# EAGLE schematic Snare (EAGLE 9.2.2)
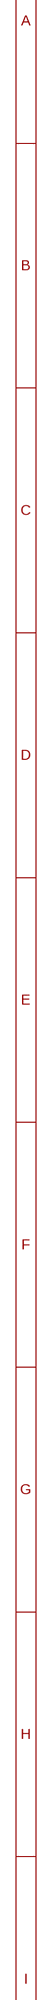
[diagram p0: schematic, sheet 1, part 1 of 2]
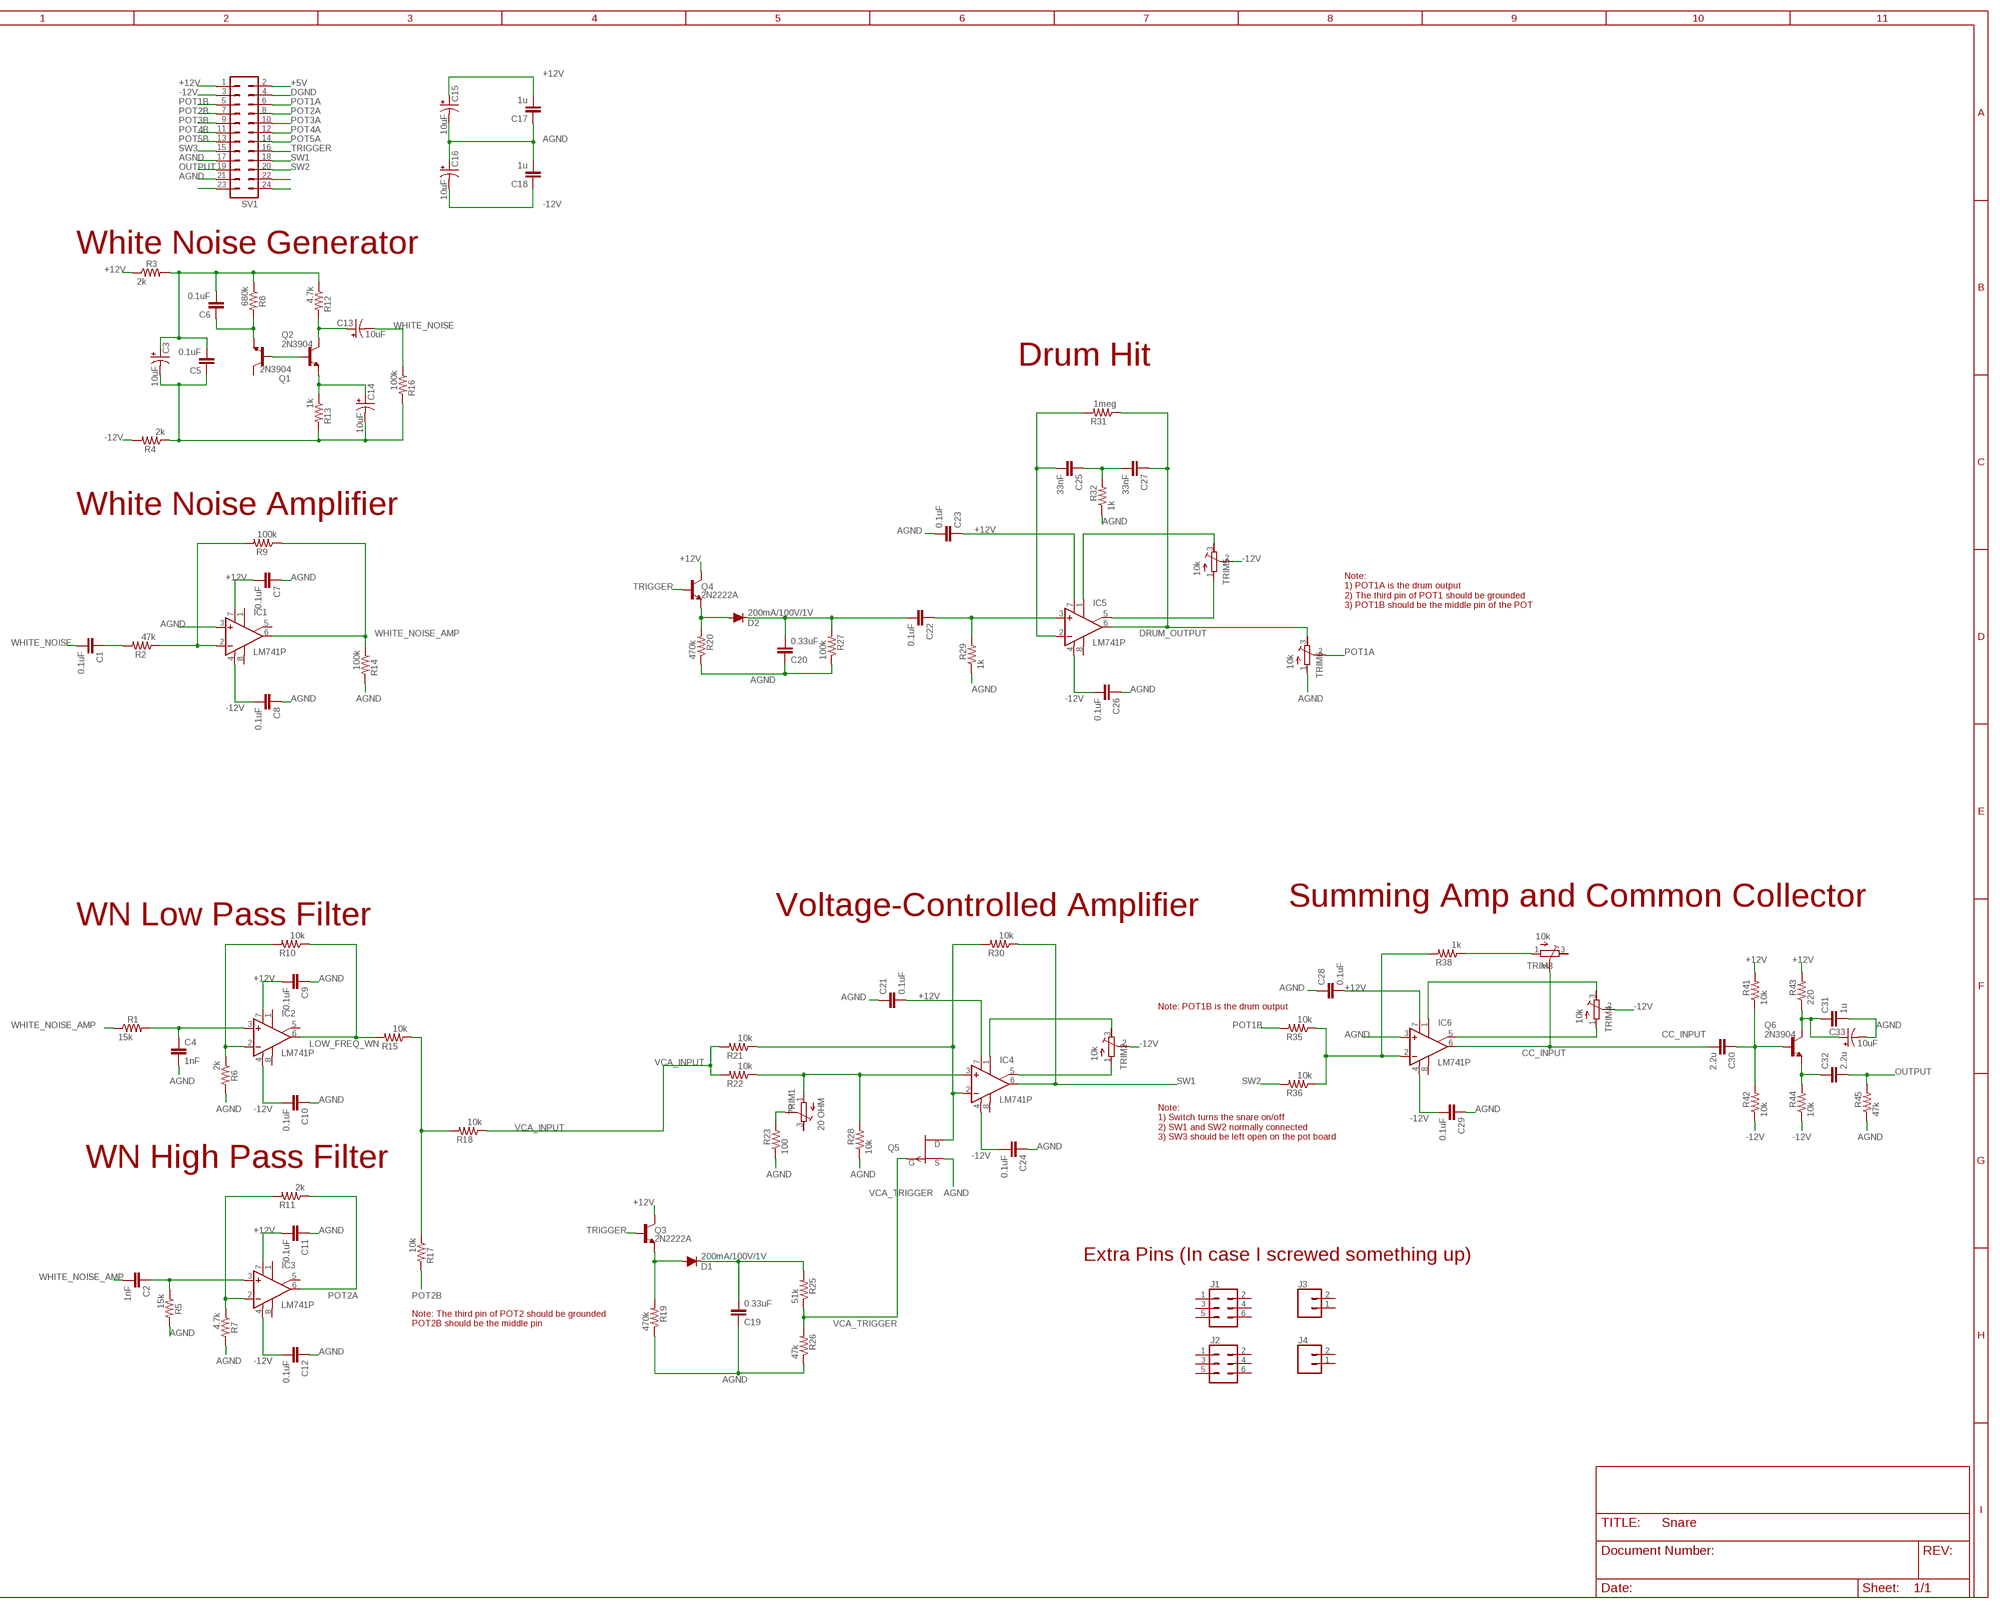
[diagram p1: schematic, sheet 1, part 2 of 2]

## Parts
C1  0.1uF  C-EU050-024X044  [C050-024X044]
C2  1nF  C-EU050-024X044  [C050-024X044]
C3  10uF  CPOL-USE2.5-6  [E2,5-6]
C4  1nF  C-EU050-024X044  [C050-024X044]
C5  0.1uF  C-EU050-024X044  [C050-024X044]
C6  0.1uF  C-EU050-024X044  [C050-024X044]
C7  0.1uF  C-EU050-024X044  [C050-024X044]
C8  0.1uF  C-EU050-024X044  [C050-024X044]
C9  0.1uF  C-EU050-024X044  [C050-024X044]
C10  0.1uF  C-EU050-024X044  [C050-024X044]
C11  0.1uF  C-EU050-024X044  [C050-024X044]
C12  0.1uF  C-EU050-024X044  [C050-024X044]
C13  10uF  CPOL-USE2.5-6  [E2,5-6]
C14  10uF  CPOL-USE2.5-6  [E2,5-6]
C15  10uF  CPOL-USE2.5-6  [E2,5-6]
C16  10uF  CPOL-USE2.5-6  [E2,5-6]
C17  1u  C-EU050-024X044  [C050-024X044]
C18  1u  C-EU050-024X044  [C050-024X044]
C19  0.33uF  C-EU050-024X044  [C050-024X044]
C20  0.33uF  C-EU050-024X044  [C050-024X044]
C21  0.1uF  C-EU050-024X044  [C050-024X044]
C22  0.1uF  C-EU050-024X044  [C050-024X044]
C23  0.1uF  C-EU050-024X044  [C050-024X044]
C24  0.1uF  C-EU050-024X044  [C050-024X044]
C25  33nF  C-EU050-024X044  [C050-024X044]
C26  0.1uF  C-EU050-024X044  [C050-024X044]
C27  33nF  C-EU050-024X044  [C050-024X044]
C28  0.1uF  C-EU050-024X044  [C050-024X044]
C29  0.1uF  C-EU050-024X044  [C050-024X044]
C30  2.2u  C-EU050-024X044  [C050-024X044]
C31  1u  C-EU050-024X044  [C050-024X044]
C32  2.2u  C-EU050-024X044  [C050-024X044]
C33  10uF  CPOL-USE2.5-6  [E2,5-6]
D1  200mA/100V/1V  DIODE-1N4148  [DIODE-1N4148]
D2  200mA/100V/1V  DIODE-1N4148  [DIODE-1N4148]
IC1  LM741P  [DIL08]
IC2  LM741P  [DIL08]
IC3  LM741P  [DIL08]
IC4  LM741P  [DIL08]
IC5  LM741P  [DIL08]
IC6  LM741P  [DIL08]
J1  CONN_03X2NO_SILK  [2X3-NS]
J2  CONN_03X2NO_SILK  [2X3-NS]
J3  CONN_021X02_NO_SILK  [1X02_NO_SILK]
J4  CONN_021X02_NO_SILK  [1X02_NO_SILK]
Q1  2N3904  [TO92]
Q2  2N3904  [TO92]
Q3  2N2222A  TRANS_NPN-P2N2222A  [TO-92]
Q4  2N2222A  TRANS_NPN-P2N2222A  [TO-92]
Q5  J176  [TO-92]
Q6  2N3904  [TO92]
R1  15k  R-US_0207/10  [0207/10]
R2  47k  R-US_0207/10  [0207/10]
R3  2k  R-US_0207/10  [0207/10]
R4  2k  R-US_0207/10  [0207/10]
R5  15k  R-US_0207/10  [0207/10]
R6  2k  R-US_0207/10  [0207/10]
R7  4.7k  R-US_0207/10  [0207/10]
R8  680k  R-US_0207/10  [0207/10]
R9  100k  R-US_0207/10  [0207/10]
R10  10k  R-US_0207/10  [0207/10]
R11  2k  R-US_0207/10  [0207/10]
R12  4.7k  R-US_0207/10  [0207/10]
R13  1k  R-US_0207/10  [0207/10]
R14  100k  R-US_0207/10  [0207/10]
R15  10k  R-US_0207/10  [0207/10]
R16  100k  R-US_0207/10  [0207/10]
R17  10k  R-US_0207/10  [0207/10]
R18  10k  R-US_0207/10  [0207/10]
R19  470k  R-US_0207/10  [0207/10]
R20  470k  R-US_0207/10  [0207/10]
R21  10k  R-US_0207/10  [0207/10]
R22  10k  R-US_0207/10  [0207/10]
R23  100  R-US_0207/10  [0207/10]
R25  51k  R-US_0207/10  [0207/10]
R26  47k  R-US_0207/10  [0207/10]
R27  100k  R-US_0207/10  [0207/10]
R28  10k  R-US_0207/10  [0207/10]
R29  1k  R-US_0207/10  [0207/10]
R30  10k  R-US_0207/10  [0207/10]
R31  1meg  R-US_0207/10  [0207/10]
R32  1k  R-US_0207/10  [0207/10]
R35  10k  R-US_0207/10  [0207/10]
R36  10k  R-US_0207/10  [0207/10]
R38  1k  R-US_0207/10  [0207/10]
R41  10k  R-US_0207/10  [0207/10]
R42  10k  R-US_0207/10  [0207/10]
R43  220  R-US_0207/10  [0207/10]
R44  10k  R-US_0207/10  [0207/10]
R45  47k  R-US_0207/10  [0207/10]
SV1  MA12-2  [MA12-2]
TRIM1  20 OHM  R-TRIMM64W  [RTRIM64W]
TRIM2  10k  R-TRIMM64W  [RTRIM64W]
TRIM3  10k  R-TRIMM64W  [RTRIM64W]
TRIM4  10k  R-TRIMM64W  [RTRIM64W]
TRIM5  10k  R-TRIMM64W  [RTRIM64W]
TRIM6  10k  R-TRIMM64W  [RTRIM64W]

## Nets
+5V: SV1.2
+12V: C7.2 C9.2 C11.2 C15.+ C17.2 C21.2 C23.1 C28.2 IC1.7(V+) IC2.7(V+) IC3.7(V+) IC4.7(V+) IC5.7(V+) IC6.7(V+) Q3.1(C) Q4.1(C) R3.1 R41.2 R43.2 SV1.1
-12V: C8.2 C10.2 C12.2 C16.- C18.1 C24.2 C26.2 C29.2 IC1.4(V-) IC2.4(V-) IC3.4(V-) IC4.4(V-) IC5.4(V-) IC6.4(V-) R4.2 R42.1 R44.1 SV1.3 TRIM2.2(S) TRIM4.2(S) TRIM5.2(S)
AGND: C4.2 C7.1 C8.1 C9.1 C10.1 C11.1 C12.1 C15.- C16.+ C17.1 C18.2 C19.1 C20.1 C21.1 C23.2 C24.1 C26.1 C28.1 C29.1 C31.2 C33.- IC1.3(+IN) IC6.3(+IN) Q5.3(S) R5.2 R6.2 R7.2 R14.2 R19.1 R20.1 R23.1 R26.1 R27.1 R28.1 R29.1 R32.1 R45.1 SV1.17 SV1.21 TRIM6.1(A)
CC_INPUT: C30.2 IC6.6(OUT) TRIM3.2(S)
DGND: SV1.4
DRUM_OUTPUT: C27.1 IC5.6(OUT) R31.1 TRIM6.3(E)
LOW_FREQ_WN: IC2.6(OUT) R10.1 R15.2
N$1: R15.1 R17.1 R18.2
N$2: IC6.2(-IN) R35.1 R36.1 R38.2
N$3: R38.1 TRIM3.1(A)
N$4: IC6.5(ON2) TRIM4.1(A)
N$5: C14.+ Q2.3(E) R13.1
N$6: C3.+ C5.2 C6.2 R3.2 R8.1 R12.1
N$7: IC6.1(ON1) TRIM4.3(E)
N$8: C25.1 C27.2 R32.2
N$17: Q1.2(B) Q2.2(B)
N$20: C6.1 Q1.3(E) R8.2
N$21: C3.- C5.1 C14.- R4.1 R13.2 R16.2
N$23: IC1.2(-IN) R2.1 R9.2
N$24: SV1.23
N$25: SV1.24
N$26: SV1.22
N$27: IC3.2(-IN) R7.1 R11.2
N$28: C1.1 R2.2
N$30: C13.+ Q2.1(C) R12.2
N$32: C2.1 IC3.3(+IN) R5.1
N$33: IC2.2(-IN) R6.1 R10.2
N$34: C4.1 IC2.3(+IN) R1.2
N$36: C20.2 C22.2 D2.C R27.2
N$37: C30.1 Q6.2(B) R41.1 R42.2
N$38: C32.1 Q6.3(E) R44.2
N$39: C31.1 C33.+ Q6.1(C) R43.1
N$40: D2.A Q4.3(E) R20.2
N$41: C22.1 IC5.3(+IN) R29.2
N$42: R23.2 TRIM1.2(S)
N$43: C25.2 IC5.2(-IN) R31.2
N$45: IC5.1(ON1) TRIM5.3(E)
N$46: IC5.5(ON2) TRIM5.1(A)
N$48: IC4.3(+IN) R22.1 R28.2 TRIM1.1(A)
N$49: IC4.2(-IN) Q5.1(D) R21.1 R30.2
N$50: IC4.1(ON1) TRIM2.3(E)
N$51: C19.2 D1.C R25.2
N$52: IC4.5(ON2) TRIM2.1(A)
N$53: D1.A Q3.3(E) R19.2
OUTPUT: C32.2 R45.2 SV1.19
POT1A: SV1.6 TRIM6.2(S)
POT1B: R35.2 SV1.5
POT2A: IC3.6(OUT) R11.1 SV1.8
POT2B: R17.2 SV1.7
POT3A: SV1.10
POT3B: SV1.9
POT4A: SV1.12
POT4B: SV1.11
POT5A: SV1.14
POT5B: SV1.13
SW1: IC4.6(OUT) R30.1 SV1.18
SW2: R36.2 SV1.20
SW3: SV1.15
TRIGGER: Q3.2(B) Q4.2(B) SV1.16
VCA_INPUT: R18.1 R21.2 R22.2
VCA_TRIGGER: Q5.2(G) R25.1 R26.2
WHITE_NOISE: C1.2 C13.- R16.1
WHITE_NOISE_AMP: C2.2 IC1.6(OUT) R1.1 R9.1 R14.1
Unconnected: IC1.1(ON1) IC1.5(ON2) IC1.8(OPT) IC2.1(ON1) IC2.5(ON2) IC2.8(OPT) IC3.1(ON1) IC3.5(ON2) IC3.8(OPT) IC4.8(OPT) IC5.8(OPT) IC6.8(OPT) J1.1 J1.2 J1.3 J1.4 J1.5 J1.6 J2.1 J2.2 J2.3 J2.4 J2.5 J2.6 J3.1 J3.2 J4.1 J4.2 Q1.1(C) TRIM1.3(E) TRIM3.3(E)

## Notes on the sheet
- White Noise Generator
- Drum Hit
- White Noise Amplifier
- Note: 
  1) POT1A is the drum output
  2) The third pin of POT1 should be grounded
  3) POT1B should be the middle pin of the POT
- Voltage-Controlled Amplifier | Summing Amp and Common Collector
- WN Low Pass Filter
- Note: POT1B is the drum output
- Note: 
  1) Switch turns the snare on/off
  2) SW1 and SW2 normally connected
  3) SW3 should be left open on the pot board
- WN High Pass Filter
- Extra Pins (In case I screwed something up)
- Note: The third pin of POT2 should be grounded
  POT2B should be the middle pin

## Library data of the parts
C1 C2 C4-C12 C17-C32 = resistor:C-EU: CAPACITOR, European symbol
C3 C13-C16 C33 = rcl:CPOL-US: POLARIZED CAPACITOR, American symbol; SPICEPREFIX: C
D1 D2 = SparkFun-DiscreteSemi:DIODE: Diode These are standard reverse protection diodes and small signal diodes. SparkFun Products: SparkFun SparkPunk Sound Kit <https://www.sparkfun.com/products/11177> SparkFun ESP8266 Thing <https://www.sparkfun.com/products/13231>; PROD_ID: DIO-08378
IC1-IC6 = linear:*741: OP AMP
J1 J2 = SparkFun-Connectors:CONN_03X2: Multi connection point. Often used as Generic Header-pin footprint for 0.1 inch spaced/style header connections You can populate with any combo of single row headers, but if you'd like an exact match, check these: Header - 2x3 (Male, 0.1") <https://www.sparkfun.com/products/12807> (PRT-12807) Header - 2x3 (Female, 0.1") <https://www.sparkfun.com/products/13010> (PRT-13010) 2x3 Pin Shrouded Header <https://www.sparkfun.com/products/10877> (PRT-10877) On any of the 0.1 inch spaced packages, you can populate with these: Break Away Headers - Straight <https://www.sparkfun.com/products/116> (PRT-00116) Break Away Male Headers - Right Angle <https://www.sparkfun.com/products/553> (PRT-00553) Female Headers <https://www.sparkfun.com/products/115> (PRT-00115) Break Away Headers - Machine Pin <https://www.sparkfun.com/products/117> (PRT-00117) Break Away Female Headers - Swiss Machine Pin <https://www.sparkfun.com/products/743> (PRT-00743) Special note: the shrouded connector mates well with our 3x2 ribbon cables: Ribbon Crimp Connector - 6-pin (2x3, Female) <https://www.sparkfun.com/products/10651> (PRT-10651) Ribbon Cable - 6 wire (15ft) <https://www.sparkfun.com/products/10646> (PRT-10646)
J3 J4 = SparkFun-Connectors:CONN_02: Multi connection point. Often used as Generic Header-pin footprint for 0.1 inch spaced/style header connections On any of the 0.1 inch spaced packages, you can populate with these: Break Away Headers - Straight <https://www.sparkfun.com/products/116> (PRT-00116) Break Away Male Headers - Right Angle <https://www.sparkfun.com/products/553> (PRT-00553) Female Headers <https://www.sparkfun.com/products/115> (PRT-00115) Break Away Headers - Machine Pin <https://www.sparkfun.com/products/117> (PRT-00117) Break Away Female Headers - Swiss Machine Pin <https://www.sparkfun.com/products/743> (PRT-00743) For SCREWTERMINALS and SPRING TERMINALS visit here: Screw Terimnals on SparkFun.com <https://www.sparkfun.com/search/results?term=Screw+Terminals> (5mm/3.5mm/2.54mm spacing) This device is also useful as a general connection point to wire up your design to another part of your project. Our various solder wires solder well into these plated through hole pads. Hook-Up Wire - Assortment (Stranded, 22 AWG) <https://www.sparkfun.com/products/11375> (PRT-11375) Hook-Up Wire - Assortment (Solid Core, 22 AWG) <https://www.sparkfun.com/products/11367> (PRT-11367) View the entire wire category on our website here <https://www.sparkfun.com/categories/141> Special notes: Molex polarized connector foot print use with: PRT-08233 with associated crimp pins and housings. 2.54_SCREWTERM for use with PRT-10571. 3.5mm Screw Terminal footprints for PRT-08084 5mm Screw Terminal footprints for use with PRT-08432
Q1 Q2 Q6 = transistor:2N3904: NPN TRANSISTOR
Q3 Q4 = SparkFun-DiscreteSemi:TRANS_NPN: NPN transistor Current controlled devices typically used to amplify current or used as a switch. BC547 - COM-08928 <http://www.sparkfun.com/products/8928> (TO-92 45V 100mA) (1.Collector 2.Base 3.Emitter) 2N3904 - COM-00521 <http://www.sparkfun.com/products/521> (TO-92 40V 200mA) (1.Emitter 2.Base 3.Collector) P2N2222A - COM-12852 <http://www.sparkfun.com/products/12852> (TO-92 40V 600mA) (1.Collector 2.Base 3.Emitter); PROD_ID: TRANS-09536; VALUE: 600mA/40V
Q5 = Capstone:J176
R1-R23 R25-R32 R35 R36 R38 R41-R45 = resistor:R-US_: RESISTOR, American symbol
SV1 = con-lstb:MA12-2: PIN HEADER; OC_FARNELL: unknown; OC_NEWARK: unknown
TRIM1-TRIM6 = rcl:R-TRIMM: Trimm resistor; SPICEMODEL: X; SPICEPREFIXL: POT